# EAGLE design SerialLink (EAGLE 9.5.1)
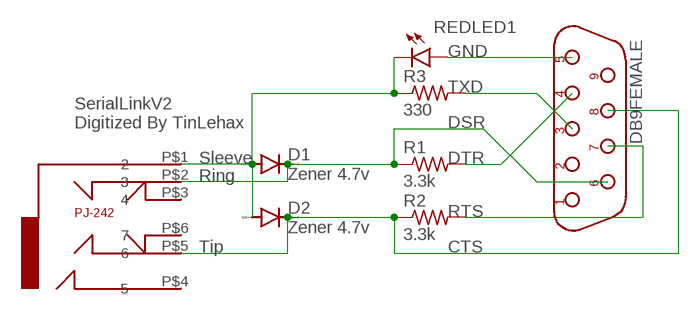
[diagram p0: schematic, sheet 1]

## Parts
D1  Zener 4.7v  PMLL4150  [SOD80C]
D2  Zener 4.7v  PMLL4150  [SOD80C]
DB9FEMALE  DB9F/90  [D-09F/90]
R1  3.3k  R-US_R0805  [R0805]
R2  3.3k  R-US_R0805  [R0805]
R3  330  R-US_R0805  [R0805]
REDLED1  LED1206  [LED-1206]
U$2  PJ-242  [PJ-242]

## Nets
N$1: D1.A D2.A R3.1 REDLED1.C U$2.P$1
N$2: D1.C DB9FEMALE.6 R1.1 U$2.P$2
N$3: D2.C DB9FEMALE.8 R2.1 U$2.P$5
N$4: DB9FEMALE.5 REDLED1.A
N$5: DB9FEMALE.3 R3.2
N$6: DB9FEMALE.7 R2.2
N$7: DB9FEMALE.4 R1.2
Unconnected: DB9FEMALE.1 DB9FEMALE.2 DB9FEMALE.9 U$2.P$3 U$2.P$4 U$2.P$6

## Notes on the sheet
- GND
- TXD
- SerialLinkV2
  Digitized By TinLehax
- DSR
- Sleeve | DTR
- Ring
- RTS
- Tip | CTS

## Library data of the parts
D1 D2 = diode:PMLL4150: DIODE high speed
DB9FEMALE = connect:DB9F/90
R1-R3 = adafruit:R-US_: RESISTOR, American symbol
REDLED1 = SparkFun-LED:LED: LED (Generic) Standard schematic elements and footprints for 5mm, 3mm, 1206, and 0603 sized LEDs. Generic LEDs with no color specified.
U$2 = PJ-242:PJ-242: PJ-242 6pin 2.5mm headphone socket; PARTNO: PJ-242 2.5mm headphone jack socket 6 pin

## Board
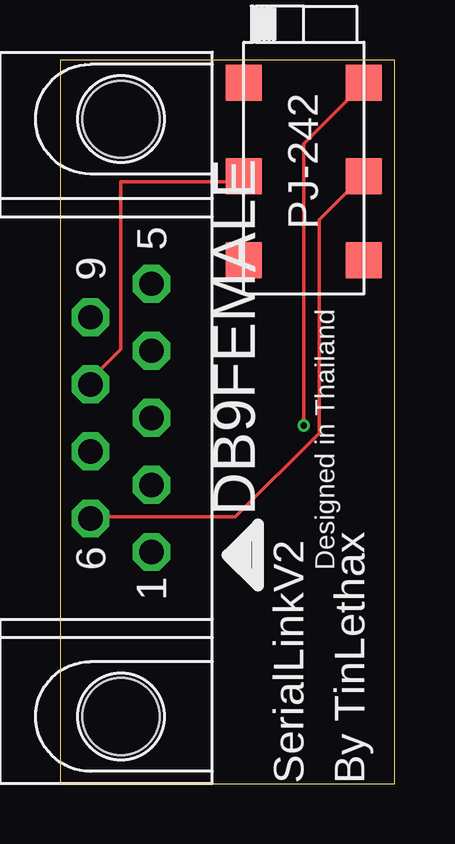
[diagram p1: board, top side]
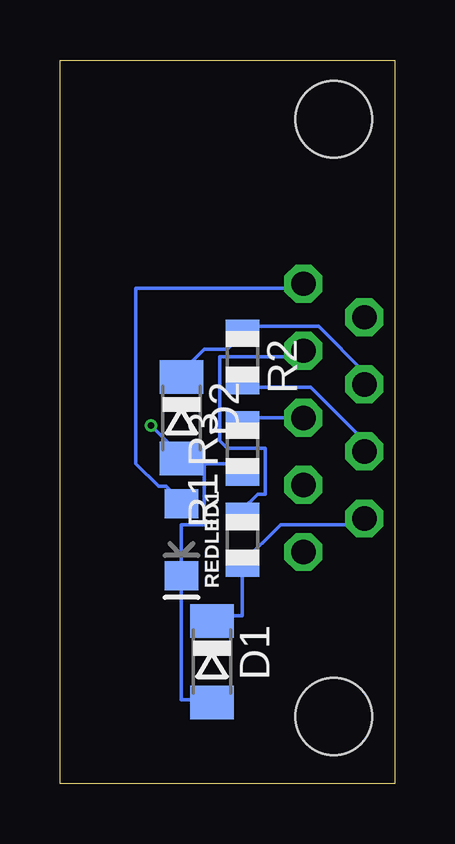
[diagram p2: board, bottom side, seen from below]

Size 13.95 x 30.15 mm. Coordinates in mm from the lower left corner, seen from the top.
Outline: 0,0 13.95,0 13.95,30.15 0,30.15 0,0
Copper layers (1*16): Top 0.035559375mm / dielectric 1.6mm / Bottom 0.035559375mm
Design rules "oshpark-2layer": minimum track width 6mil, minimum drill 10mil, track to track 6mil, track to pad 6mil, pad to pad 6mil, via to via 6mil, smd to smd 6mil, copper to edge 15mil, drill to drill 6mil, minimum pad ring 5mil, minimum via ring 5mil, stop-mask expansion 2.5mil, vias tented up to drill 0mil, thermal gap 10mil

### Footprints (pad centres in the part's own frame; a part is rotated, then mirrored left to right if it is on the bottom)
SOD80C = smd 1.4 x 1.8: A 1.7,0; C -1.7,0
D-09F/90 = drill 1.016 pad 1.575 octagon: 1 -5.588,-1.27; 2 -2.794,-1.27; 3 0,-1.27; 4 2.794,-1.27; 5 5.588,-1.27; 6 -4.191,1.27; 7 -1.397,1.27; 8 1.397,1.27; 9 4.191,1.27 | hole 3.2: 12.446,0; -12.446,0
R0805 = smd 1.1 x 1.4: 1 -1,0; 2 1,0
LED-1206 = smd 1.2 x 1.4: A -1.5,0; C 1.5,0
PJ-242 = smd 1.5 x 1.5: P$1 2.5,3.8; P$2 2.5,-0.1; P$3 2.5,-3.6; P$4 -2.5,-3.6; P$5 -2.5,-0.1; P$6 -2.5,3.8

### Placement (x,y rotation side)
D1  7.62,5.08 270 bottom
D2  8.89,15.24 270 bottom
DB9FEMALE  2.54,15.24 90 top
R1  6.35,10.16 90 bottom
R2  6.35,17.78 270 bottom
R3  6.35,13.97 90 bottom
REDLED1  8.89,10.16 270 bottom
U$2  10.16,25.4 0 top

### Tracks (layer width: path | path; a pad name or v marks a point on that pad's centre or on a via)
N$1  (via drill 0.25)
  Top 0.152: v10.16,14.92 10.16,26.67 12.38,28.89 U$2.P$1
  Bottom 0.152: D1.A 7.62,3.49 8.89,3.49 REDLED1.C 8.89,10.79 7.94,10.79 7.94,13.34 | 7.94,13.34 8.89,13.34 D2.A 8.89,13.65 v10.16,14.92 | 7.94,13.34 6.67,13.34 6.35,13.02 R3.1
N$2
  Top 0.152: U$2.P$2 12.38,25.08 10.79,23.5 10.79,14.61 7.3,11.11 1.27,11.11 DB9FEMALE.6
  Bottom 0.152: D1.C 7.62,6.99 6.35,6.99 R1.1 6.35,9.21 4.76,10.79 1.27,10.79 DB9FEMALE.6
N$3
  Top 0.152: U$2.P$5 7.62,25.08 2.54,25.08 2.54,18.1 1.27,16.83 DB9FEMALE.8
  Bottom 0.152: D2.C 8.89,17.14 7.94,18.1 6.99,18.1 6.35,18.73 R2.1 6.35,19.05 3.17,19.05 1.27,17.14 DB9FEMALE.8
N$4
  Bottom 0.152: REDLED1.A 8.89,11.75 9.53,12.38 9.84,12.38 10.79,13.34 10.79,20.64 3.81,20.64 DB9FEMALE.5
N$5
  Bottom 0.152: DB9FEMALE.3 6.35,15.24 R3.2
N$6
  Bottom 0.152: DB9FEMALE.7 1.27,14.29 3.49,16.51 6.35,16.51 R2.2
N$7
  Bottom 0.152: R1.2 6.35,11.43 5.71,12.06 5.4,12.06 5.4,13.97 6.99,13.97 7.3,14.29 7.3,17.78 3.81,17.78 DB9FEMALE.4

### Text on the board
tNames: Designed in Thailand | SerialLinkV2 | By TinLethax